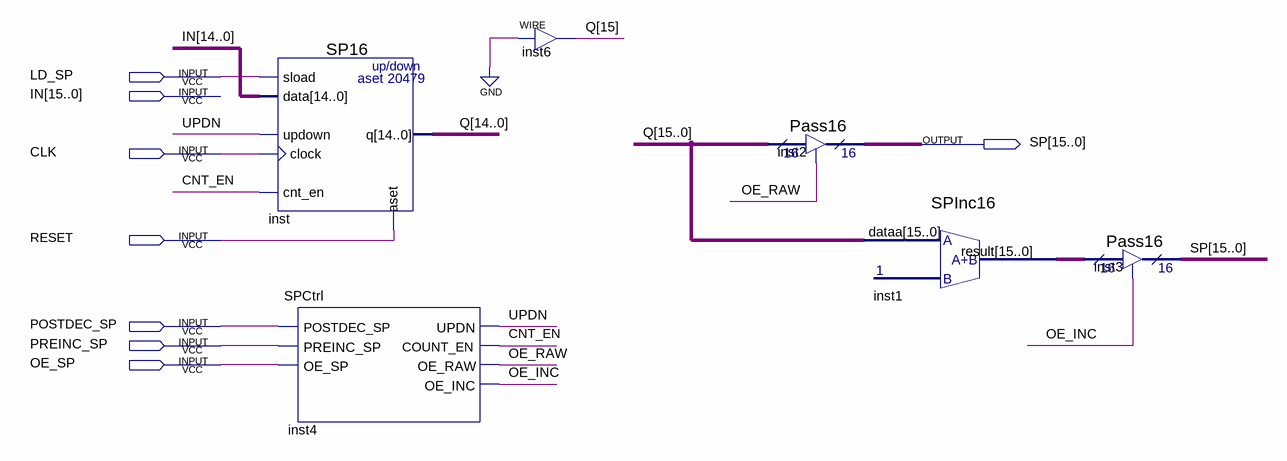
[diagram p0: schematic sheet]
// Quartus schematic SPReg.bdf as structural Verilog: 6 symbols, 8 pins
module SPReg (
  input  LD_SP,
  input  [15:0] IN,
  input  CLK,
  input  RESET,
  input  POSTDEC_SP,
  input  PREINC_SP,
  input  OE_SP,
  output [15:0] SP
);

  wire CNT_EN, OE_INC, OE_RAW, UPDN;
  wire [15:0] inst1_result, Q;

  SP16 inst (.sload(LD_SP), .data(IN[14:0]), .updown(UPDN), .clock(CLK), .cnt_en(CNT_EN), .aset(RESET), .q(Q[14:0]));
  SPCtrl inst4 (
    .POSTDEC_SP(POSTDEC_SP), .PREINC_SP(PREINC_SP), .OE_SP(OE_SP), .UPDN(UPDN), .COUNT_EN(CNT_EN),
    .OE_RAW(OE_RAW), .OE_INC(OE_INC));
  assign Q[15] = 1'b0;  // WIRE inst6
  Pass16 inst2 (.enabledt(OE_RAW), .data(Q), .tridata(SP));
  SPInc16 inst1 (.dataa(Q), .result(inst1_result));
  Pass16 inst3 (.enabledt(OE_INC), .data(inst1_result), .tridata(SP));
endmodule
